# EAGLE schematic MD2017_Base (EAGLE 6.2)
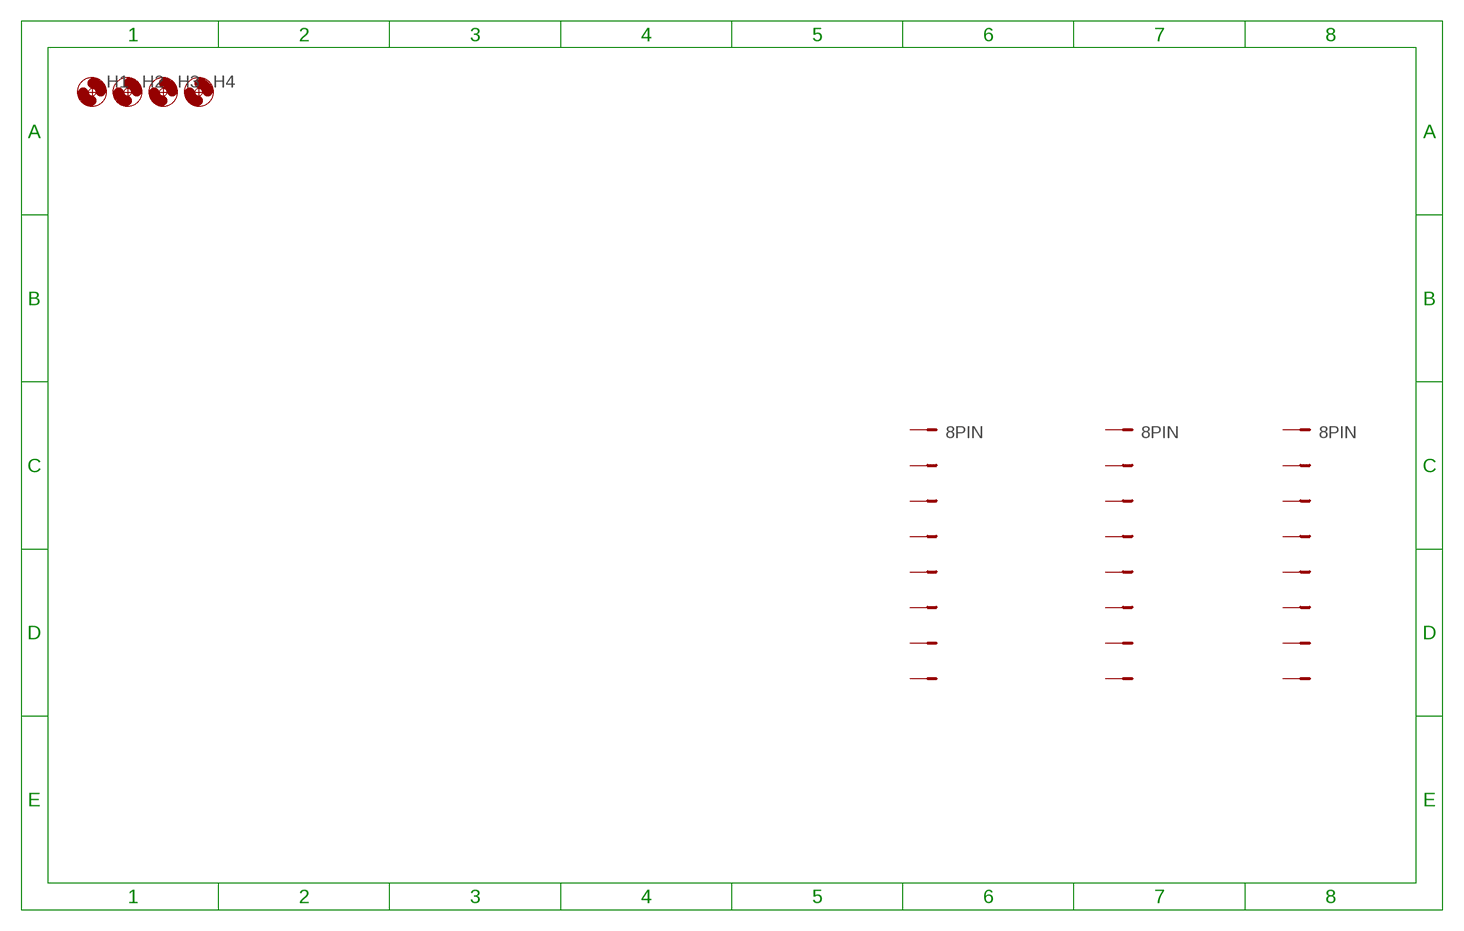
[diagram p0: schematic, sheet 1]

## Parts
H1  HOLE3.3M3BOLT  [HOLE3.3]
H2  HOLE3.3M3BOLT  [HOLE3.3]
H3  HOLE3.3M3BOLT  [HOLE3.3]
H4  HOLE3.3M3BOLT  [HOLE3.3]
POWERNPORT  8PIN  [FH105-1X8SG]
POWERPPORT  8PIN  [FH105-1X8SG]
SIGNALPORT  8PIN  [FH105-1X8SG]
Unconnected: POWERNPORT.1 POWERNPORT.2 POWERNPORT.3 POWERNPORT.4 POWERNPORT.5 POWERNPORT.6 POWERNPORT.7 POWERNPORT.8 POWERPPORT.1 POWERPPORT.2 POWERPPORT.3 POWERPPORT.4 POWERPPORT.5 POWERPPORT.6 POWERPPORT.7 POWERPPORT.8 SIGNALPORT.1 SIGNALPORT.2 SIGNALPORT.3 SIGNALPORT.4 SIGNALPORT.5 SIGNALPORT.6 SIGNALPORT.7 SIGNALPORT.8

## Library data of the parts
H1-H4 = FP-21T for MITS:HOLE3.3
POWERNPORT POWERPPORT SIGNALPORT = FH105:8PIN